# EAGLE design contact (EAGLE 9.2.2)
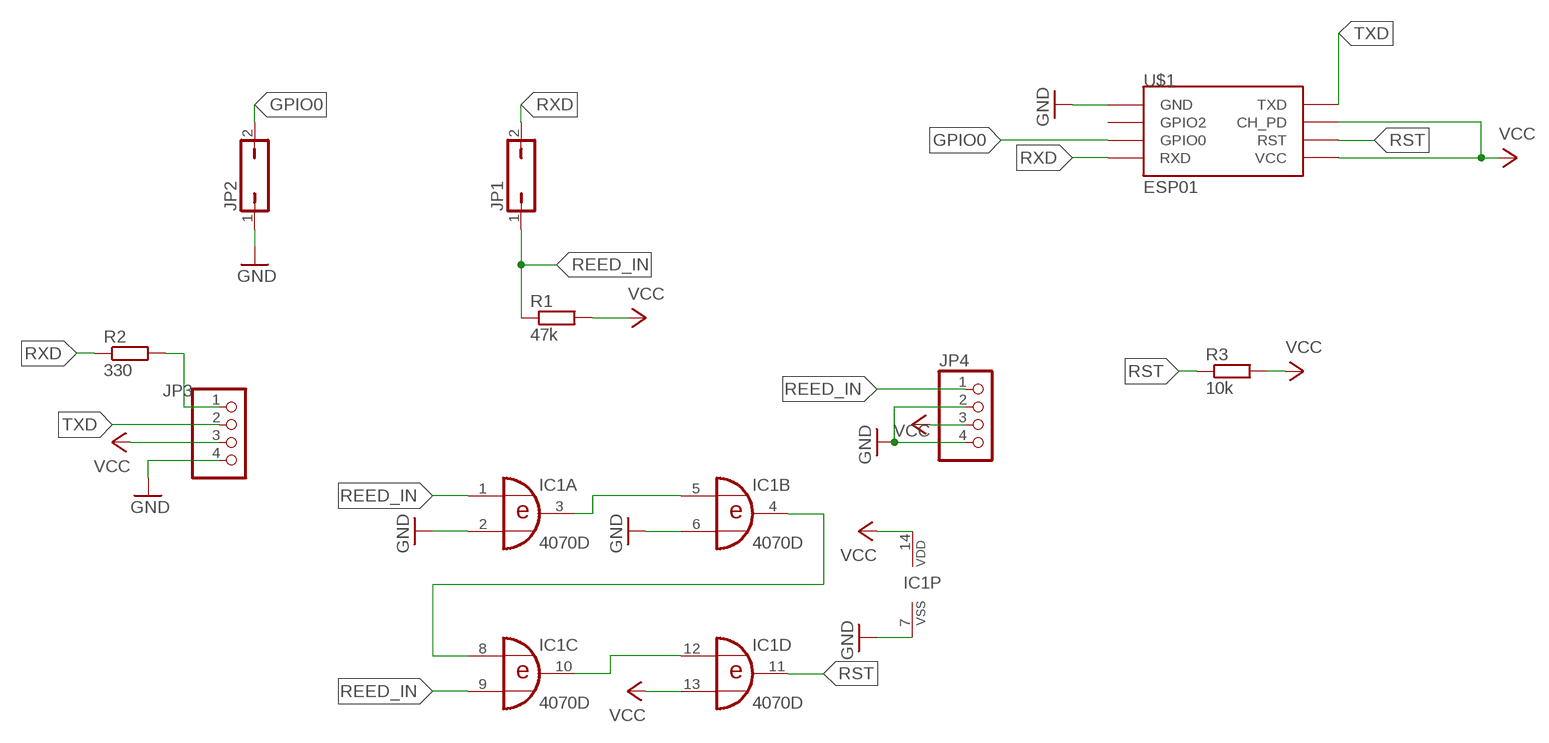
[diagram p0: schematic, sheet 1]

## Parts
IC1  4070D  [SO14]
JP1  JP1Q  [JP1]
JP2  JP1Q  [JP1]
JP3  PINHD-1X4  [1X04]
JP4  PINHD-1X4  [1X04]
R1  47k  R-EU_R0805  [R0805]
R2  330  R-EU_R0805  [R0805]
R3  10k  R-EU_R0805  [R0805]
U$1  ESP01  [ESP01]

## Nets
GND: IC1.2(A:I1) IC1.6(B:I1) IC1.7(P:VSS) JP2.1 JP3.4 JP4.2 JP4.4 U$1.GND
GPIO0: JP2.2 U$1.GPIO0
N$1: JP3.1 R2.2
N$2: IC1.4(B:O) IC1.8(C:I0)
N$3: IC1.3(A:O) IC1.5(B:I0)
N$4: IC1.10(C:O) IC1.12(D:I0)
REED_IN: IC1.1(A:I0) IC1.9(C:I1) JP1.1 JP4.1 R1.1
RST: IC1.11(D:O) R3.1 U$1.RST
RXD: JP1.2 R2.1 U$1.RX(RXD)
TXD: JP3.2 U$1.TX(TXD)
VCC: IC1.13(D:I1) IC1.14(P:VDD) JP3.3 JP4.3 R1.2 R3.2 U$1.CH_PD U$1.VCC
Unconnected: U$1.GPIO2

## Library data of the parts
IC1 = 40xx:4070: Quad 2-input XOR
JP1 JP2 = jumper:JP1Q: JUMPER
JP3 JP4 = pinhead:PINHD-1X4: PIN HEADER
R1-R3 = resistor:R-EU_: RESISTOR, European symbol
U$1 = esp8266modules:ESP01: ESP8266 Wifi module 01

## Net classes
0 default: width 0.305 mm, drill 0.508 mm, clearance 0.305 mm

## Board
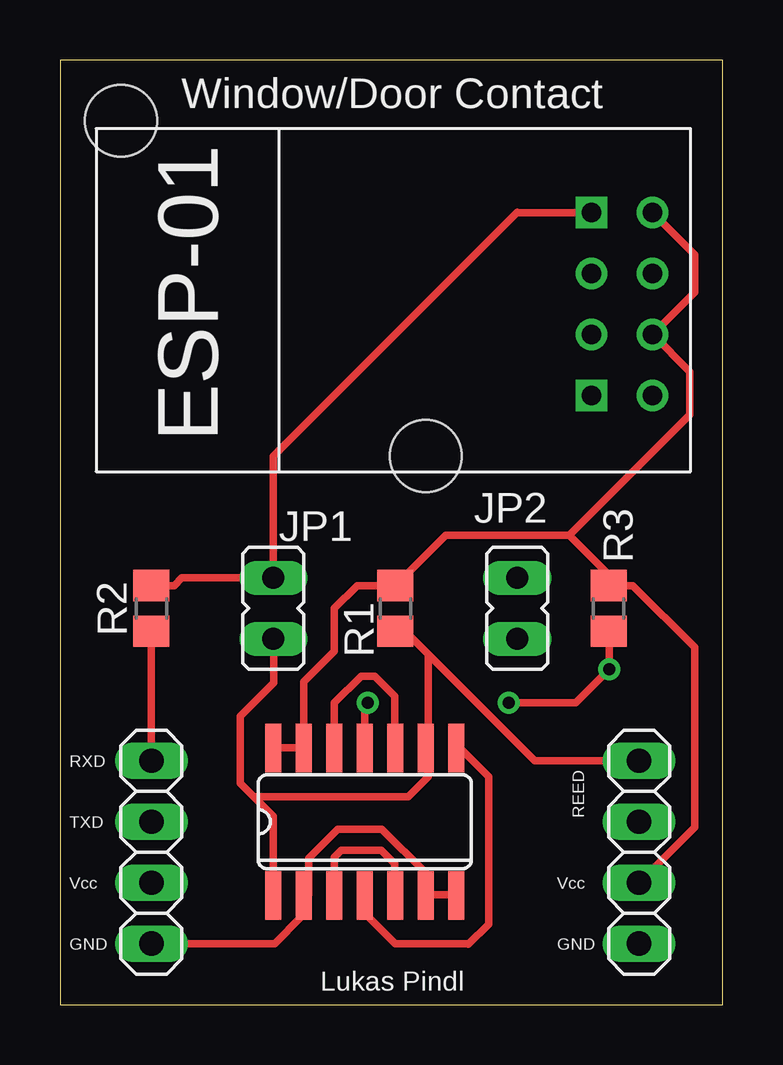
[diagram p1: board, top side]
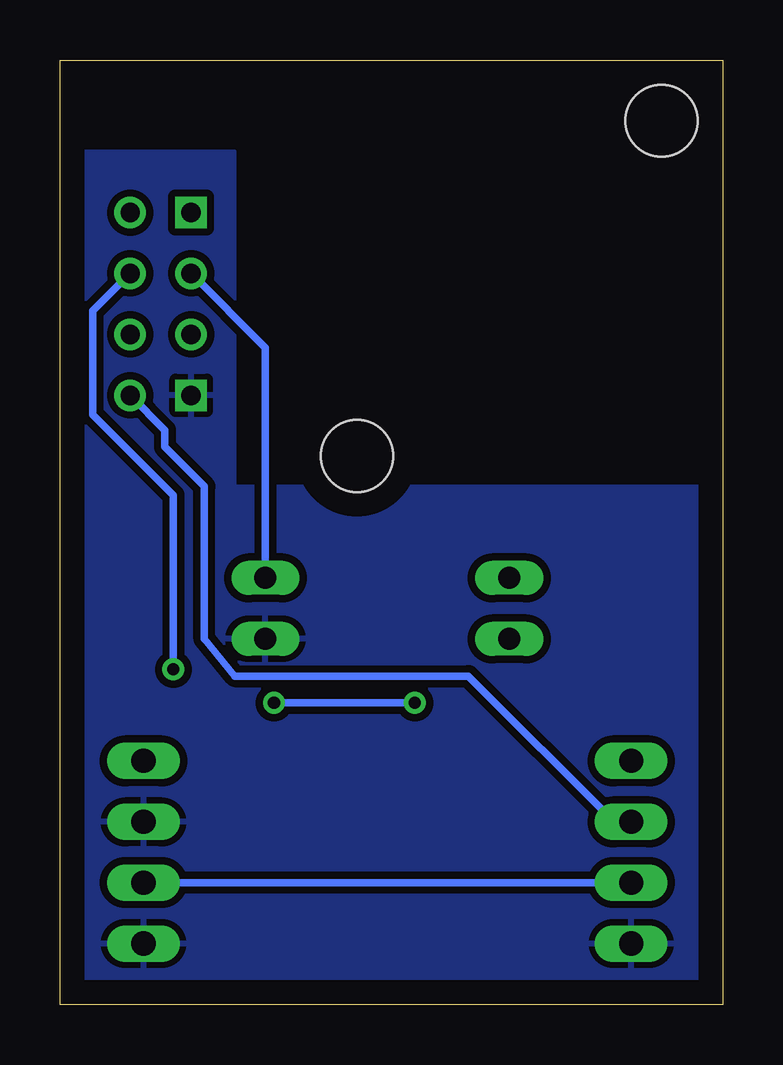
[diagram p2: board, bottom side, seen from below]

Size 27.61 x 39.36 mm. Coordinates in mm from the lower left corner, seen from the top.
Outline: 0,0 27.61,0 27.61,39.36 0,39.36 0,0
Copper layers (1*16): Top 0.035mm / dielectric 1.5mm / Bottom 0.035mm
Design rules "default *": minimum track width 6mil, minimum drill 0.4mm, track to track 6mil, track to pad 6mil, pad to pad 6mil, via to via 6mil, smd to smd 6mil, copper to edge 40mil, drill to drill 6mil, minimum pad ring 10mil, minimum via ring 8mil, stop-mask expansion 4mil, vias tented up to drill 0mil, thermal gap 10mil
Holes 3 mm at 2.54,36.83 15.24,22.86

### Footprints (pad centres in the part's own frame; a part is rotated, then mirrored left to right if it is on the bottom)
SO14 = smd 0.66 x 2.032: 1 -3.81,-3.073; 2 -2.54,-3.073; 3 -1.27,-3.073; 4 0,-3.073; 5 1.27,-3.073; 6 2.54,-3.073; 7 3.81,-3.073; 8 3.81,3.073; 9 2.54,3.073; 10 1.27,3.073; 11 0,3.073; 12 -1.27,3.073; 13 -2.54,3.073; 14 -3.81,3.073
JP1 = drill 0.914 long: 1 0,-1.27; 2 0,1.27
1X04 = drill 1.016 long: 1 -3.81,0; 2 -1.27,0; 3 1.27,0; 4 3.81,0
R0805 = smd 1.3 x 1.5: 1 -0.95,0; 2 0.95,0
ESP01 = drill 0.8: CH_PD -1.285,-8.178; GPIO0 1.255,-5.638; GPIO2 -1.285,-5.638; RST 1.255,-8.178; TX -3.825,-8.178; VCC 3.795,-8.178 | drill 0.8 square: GND -3.825,-5.638; RX 3.795,-5.638

### Placement (x,y rotation side)
IC1  12.7,7.62 0 top
JP1  8.89,16.51 0 top
JP2  19.05,16.51 0 top
JP3  3.81,6.35 270 top
JP4  24.13,6.35 270 top
R1  13.97,16.51 90 top
R2  3.81,16.51 270 top
R3  22.86,16.51 90 top
U$1  16.51,29.21 90 top

### Tracks (layer width: path | path; a pad name or v marks a point on that pad's centre or on a via)
GND
  Top 0.305: 15.24,4.57 16.46,4.57 IC1.7 | 15.24,4.57 15.24,5.49 13.41,7.32 11.58,7.32 10.36,6.1 10.36,4.57 IC1.2 10.06,4.27 10.06,3.66 8.94,2.54 JP3.4 | 15.24,4.57 IC1.6
  pour Bottom: -1.27,0 -1.27,21.59 20.32,21.59 20.32,35.56 29.21,35.56 29.21,-1.27 -1.27,-1.27
GPIO0
  Bottom 0.305: U$1.GPIO0 19.05,27.37 JP2.2
N$1
  Top 0.305: JP3.1 R2.2
N$2
  Top 0.305: IC1.4 12.7,3.81 13.97,2.54 16.99,2.54 17.02,2.52 17.86,3.35 17.86,9.5 16.66,10.69 IC1.8
N$3
  Top 0.305: IC1.3 11.43,6.15 11.71,6.43 13.39,6.43 13.95,5.87 13.95,4.75 13.96,4.57 14.02,4.57 IC1.5
N$4
  Top 0.305: IC1.12 11.43,12.57 12.55,13.69 13.11,13.69 13.95,12.85 13.95,10.9 13.96,10.69 14.02,10.67 IC1.10
REED_IN
  Top 0.305: 15.34,14.61 19.79,10.16 JP4.1 | 15.34,14.61 14.39,15.56 R1.1 | 15.34,14.61 15.34,10.9 15.24,10.97 IC1.9 15.24,10.67 15.34,10.62 15.34,9.5 14.5,8.66 8.08,8.66 | JP1.1 8.9,15.24 8.9,15.09 8.91,13.41 7.52,12.01 7.52,9.22 7.73,9 8.08,8.66 | 8.08,8.66 8.89,7.85 IC1.1
RST  (via drill 0.51)
  Top 0.305: v18.69,12.57 21.49,12.57 v22.89,13.97 22.89,15.54 R3.1 | v12.83,12.57 12.7,12.45 IC1.11
  Bottom 0.305: v22.89,13.97 22.89,21.23 26.24,24.59 26.24,28.91 U$1.RST | v18.69,12.57 v12.83,12.57
RXD
  Top 0.305: U$1.RX 19.07,33.01 19.05,33.02 8.89,22.86 JP1.2 5.08,17.78 4.76,17.46 R2.1
TXD
  Bottom 0.305: JP3.2 4.52,7.62 10.59,13.69 20.32,13.69 21.59,15.24 21.59,21.59 23.24,23.24 23.24,23.94 U$1.TX
VCC
  Top 0.305: 21.21,19.56 26.24,24.59 26.24,26.37 U$1.CH_PD 26.44,29.68 26.44,31.25 U$1.VCC | IC1.14 IC1.13 10.16,13.46 11.43,14.73 11.43,16.51 12.38,17.46 R1.2 16.07,19.56 21.21,19.56 | 21.21,19.56 22.86,17.91 R3.2 23.87,17.46 26.44,14.88 26.44,7.39 JP4.3
  Bottom 0.305: JP3.3 JP4.3

### Text on the board
tNames: Window/Door Contact | RXD | REED | TXD | Vcc | Vcc | GND | GND | Lukas Pindl